# EAGLE design ASD2412 (EAGLE 6.3)
DATABASE: ./../../../../../Components/TinyCircuits_Part_Database.txt
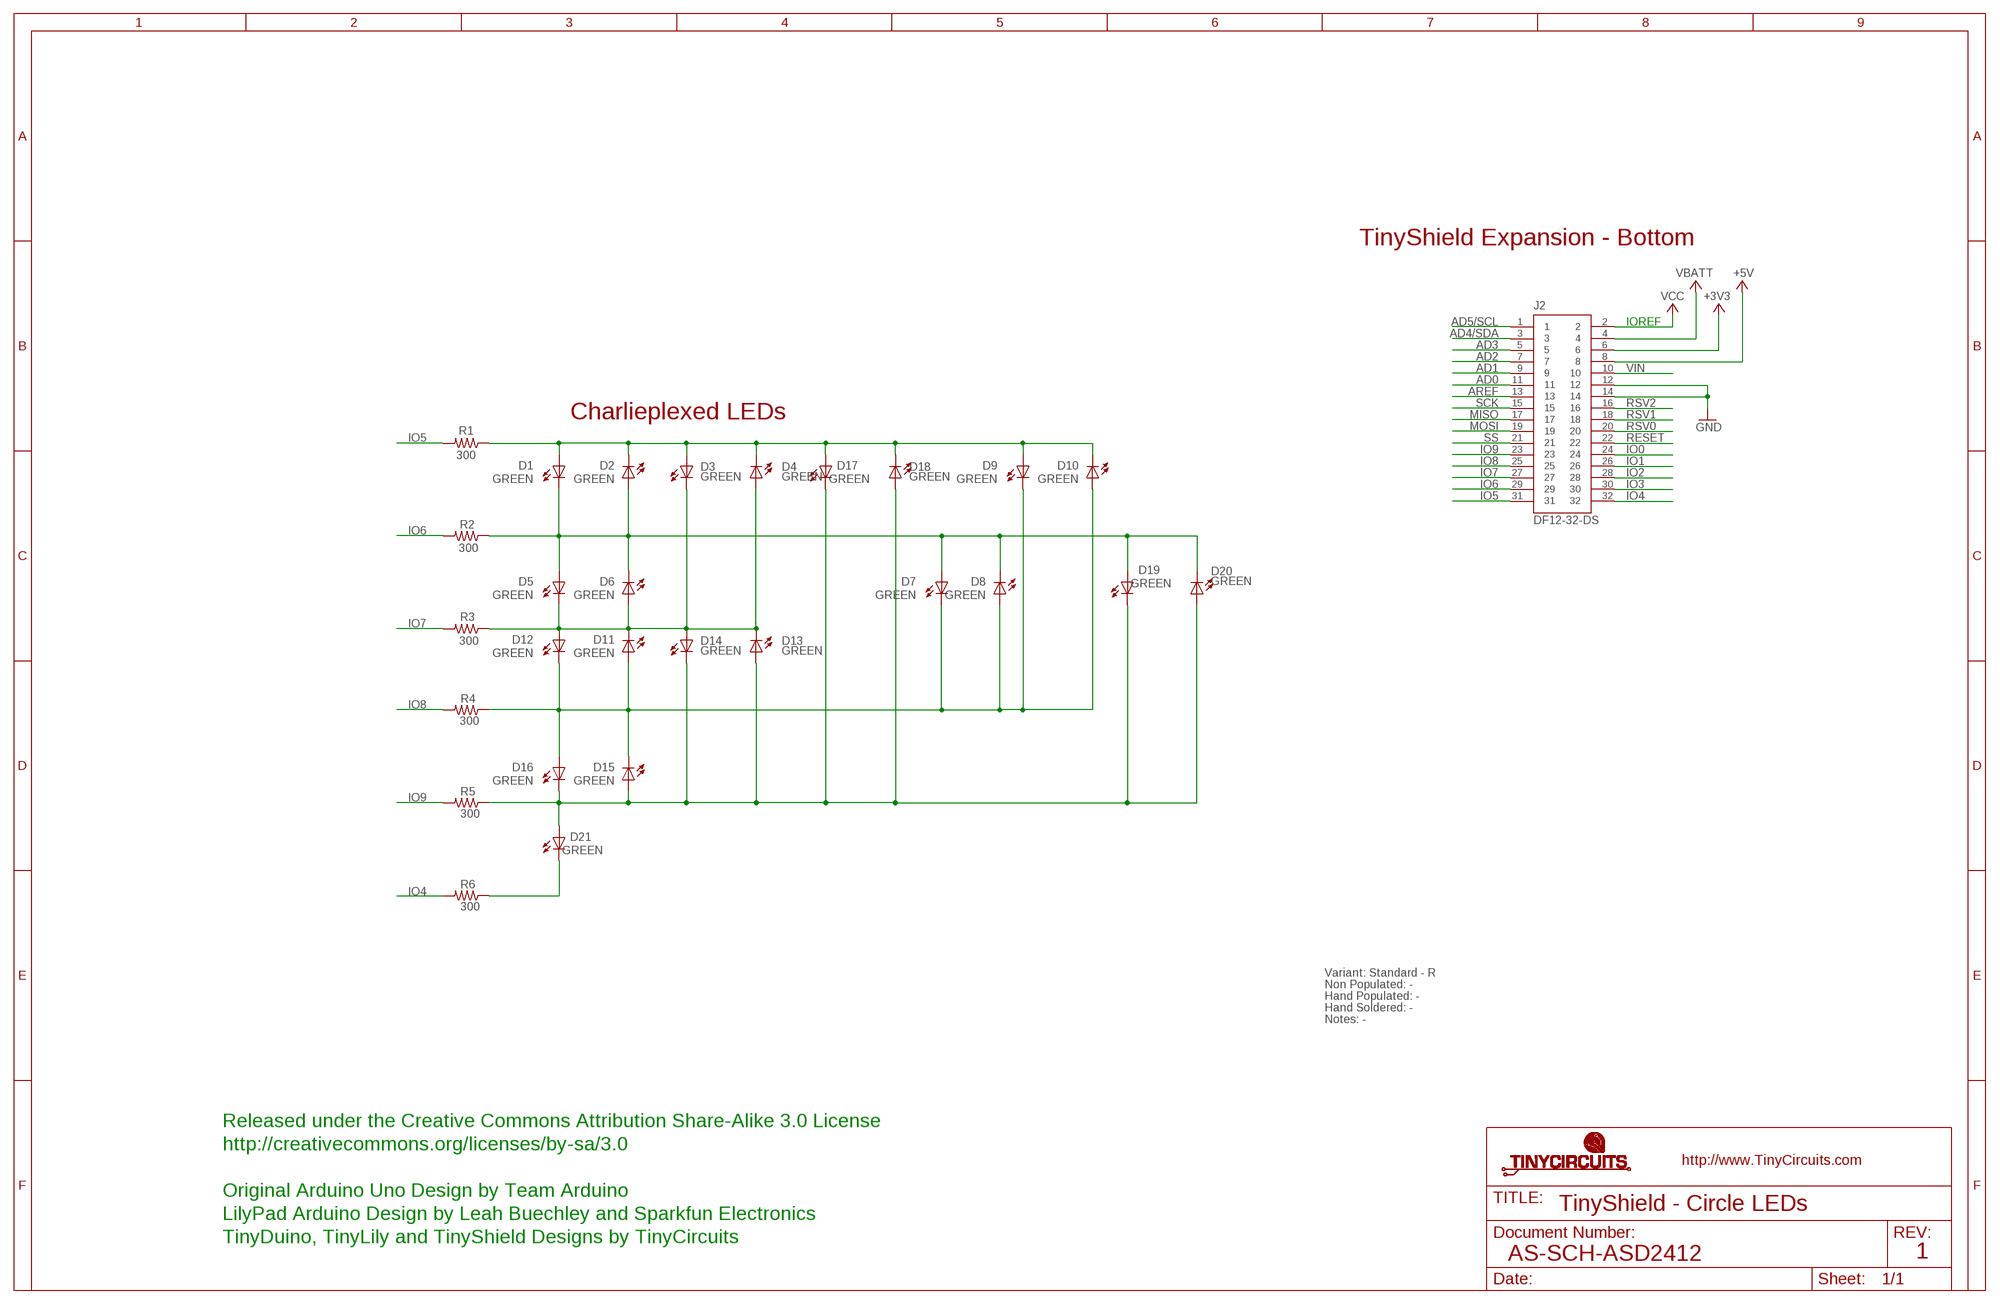
[diagram p0: schematic, sheet 1]

## Parts
D1  GREEN  AS-ITM-00011  [LNJ_LED]
D2  GREEN  AS-ITM-00011  [LNJ_LED]
D3  GREEN  AS-ITM-00011  [LNJ_LED]
D4  GREEN  AS-ITM-00011  [LNJ_LED]
D5  GREEN  AS-ITM-00011  [LNJ_LED]
D6  GREEN  AS-ITM-00011  [LNJ_LED]
D7  GREEN  AS-ITM-00011  [LNJ_LED]
D8  GREEN  AS-ITM-00011  [LNJ_LED]
D9  GREEN  AS-ITM-00011  [LNJ_LED]
D10  GREEN  AS-ITM-00011  [LNJ_LED]
D11  GREEN  AS-ITM-00011  [LNJ_LED]
D12  GREEN  AS-ITM-00011  [LNJ_LED]
D13  GREEN  AS-ITM-00011  [LNJ_LED]
D14  GREEN  AS-ITM-00011  [LNJ_LED]
D15  GREEN  AS-ITM-00011  [LNJ_LED]
D16  GREEN  AS-ITM-00011  [LNJ_LED]
D17  GREEN  AS-ITM-00011  [LNJ_LED]
D18  GREEN  AS-ITM-00011  [LNJ_LED]
D19  GREEN  AS-ITM-00011  [LNJ_LED]
D20  GREEN  AS-ITM-00011  [LNJ_LED]
D21  GREEN  AS-ITM-00011  [LNJ_LED]
J2  DF12-32-DS  AS-ITM-00012  [DF12-32-DS]
R1  300  AS-ITM-00016  [0402]
R2  300  AS-ITM-00016  [0402]
R3  300  AS-ITM-00016  [0402]
R4  300  AS-ITM-00016  [0402]
R5  300  AS-ITM-00016  [0402]
R6  300  AS-ITM-00016  [0402]

## Nets
+3V3: J2.6
+5V: J2.8
AD0: J2.11
AD1: J2.9
AD2: J2.7
AD3: J2.5
AD4/SDA: J2.3
AD5/SCL: J2.1
AREF: J2.13
GND: J2.12 J2.14
IO0: J2.24
IO1: J2.26
IO2: J2.28
IO3: J2.30
IO4: J2.32 R6.2
IO5: J2.31 R1.2
IO6: J2.29 R2.2
IO7: J2.27 R3.2
IO8: J2.25 R4.2
IO9: J2.23 R5.2
MISO: J2.17
MOSI: J2.19
N$1: D1.C D2.A D5.A D6.C D7.A D8.C D19.A D20.C R2.1
N$3: D21.C R6.1
N$11: D1.A D2.C D3.A D4.C D9.A D10.C D17.A D18.C R1.1
N$13: D3.C D4.A D5.C D6.A D11.C D12.A D13.C D14.A R3.1
N$14: D7.C D8.A D9.C D10.A D11.A D12.C D15.C D16.A R4.1
N$15: D13.A D14.C D15.A D16.C D17.C D18.A D19.C D20.A D21.A R5.1
RESET: J2.22
RSV0: J2.20
RSV1: J2.18
RSV2: J2.16
SCK: J2.15
SS: J2.21
VBATT: J2.4
VCC: J2.2
VIN: J2.10

## Notes on the sheet
- TinyShield Expansion - Bottom
- IOREF
- Charlieplexed LEDs
- Variant: Standard - R
- Non Populated: -
- Hand Populated: -
- Hand Soldered: -
- Notes: -
- Released under the Creative Commons Attribution Share-Alike 3.0 License
- http://creativecommons.org/licenses/by-sa/3.0
- Original Arduino Uno Design by Team Arduino
- TinyShield - Circle LEDs
- LilyPad Arduino Design by Leah Buechley and Sparkfun Electronics
- TinyDuino, TinyLily and TinyShield Designs by TinyCircuits
- AS-SCH-ASD2412 | 1

## Library data of the parts
D1-D21 = tinycircuits:AS-ITM-00011: LED GREEN SIDE VIEW SMD; PARTNO: AS-ITM-00011; PNPROTATION: 90
J2 = tinycircuits:AS-ITM-00012: CONN RECEPT 32POS 3MM SMD 0.5MM; PARTNO: AS-ITM-00012
R1-R6 = tinycircuits:AS-ITM-00016: RES 300 OHM 1/16W 1% 0402; PARTNO: AS-ITM-00016

## Board
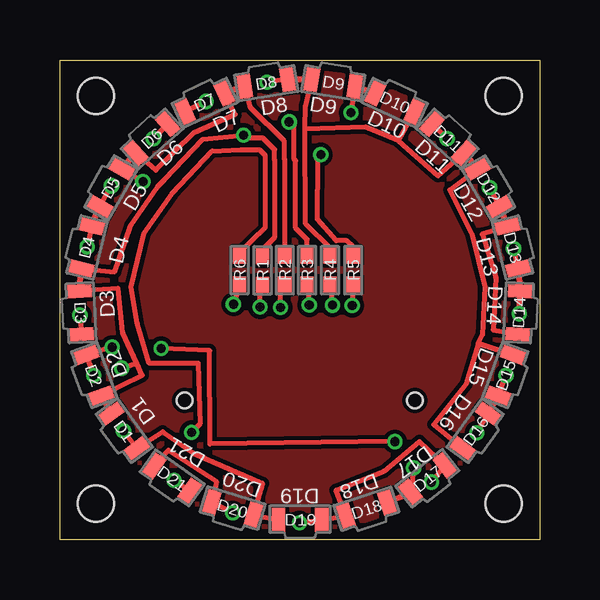
[diagram p1: board, top side]
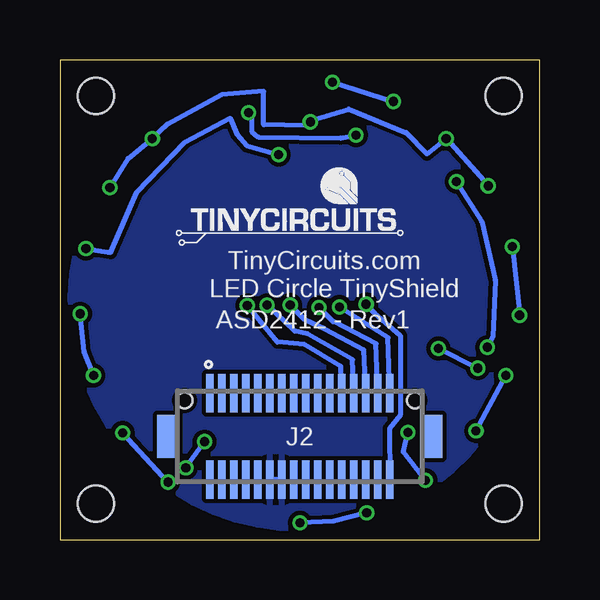
[diagram p2: board, bottom side, seen from below]

Size 20 x 20 mm. Coordinates in mm from the lower left corner, seen from the top.
Outline: 0,20 20,20 20,0 0,0 0,20
Copper layers (1*16): Top 0.035mm / dielectric 1.5mm / Bottom 0.035mm
Design rules "default *": minimum track width 8mil, minimum drill 15mil, track to track 7mil, track to pad 7mil, pad to pad 7mil, via to via 7mil, smd to smd 7mil, copper to edge 8mil, drill to drill 8mil, minimum pad ring 10mil, minimum via ring 5mil, stop-mask expansion 4mil, vias tented up to drill 25mil, thermal gap 10mil
Holes 1.5 mm at 1.5,18.5 18.5,18.5 18.5,1.5 1.5,1.5

### Footprints (pad centres in the part's own frame; a part is rotated, then mirrored left to right if it is on the bottom)
LNJ_LED = smd 1 x 0.55: A 0,0.9; C 0,-0.9
DF12-32-DS = smd 0.3 x 1.6: 1 -3.75,1.8; 2 -3.75,-1.8; 3 -3.25,1.8; 4 -3.25,-1.8; 5 -2.75,1.8; 6 -2.75,-1.8; 7 -2.25,1.8; 8 -2.25,-1.8; 9 -1.75,1.8; 10 -1.75,-1.8; 11 -1.25,1.8; 12 -1.25,-1.8; 13 -0.75,1.8; 14 -0.75,-1.8; 15 -0.25,1.8; 16 -0.25,-1.8; 17 0.25,1.8; 18 0.25,-1.8; 19 0.75,1.8; 20 0.75,-1.8; 21 1.25,1.8; 22 1.25,-1.8; 23 1.75,1.8; 24 1.75,-1.8; 25 2.25,1.8; 26 2.25,-1.8; 27 2.75,1.8; 28 2.75,-1.8; 29 3.25,1.8; 30 3.25,-1.8; 31 3.75,1.8; 32 3.75,-1.8 | smd 0.9 x 1.8: F1 -5.5,0; F2 5.5,0 | hole 0.65: -4.8,1.5; 4.8,1.5
0402 = smd 0.65 x 0.55: 1 -0.6,0; 2 0.6,0

### Placement (x,y rotation side)
D1  2.66,4.53 36 top
D2  1.41,6.85 20 top
D3  0.86,9.46 3 top
D4  1.11,12.18 346 top
D5  2.12,14.67 330 top
D6  3.82,16.73 312 top
D7  6.03,18.23 295 top
D8  8.6,19.05 279 top
D9  11.4,19.05 261 top
D10  13.97,18.23 245 top
D11  16.18,16.73 228 top
D12  17.88,14.67 210 top
D13  18.89,12.18 194 top
D14  19.14,9.46 177 top
D15  18.59,6.85 160 top
D16  17.34,4.53 144 top
D17  15.34,2.53 128 top
D18  12.78,1.26 108 top
D19  10.02,0.83 90 top
D20  7.2,1.29 73 top
D21  4.67,2.55 55 top
J2  10,4.3 0 bottom
R1  8.45,11.22 270 top
R2  9.38,11.24 270 top
R3  10.31,11.24 270 top
R4  11.26,11.24 270 top
R5  12.23,11.24 270 top
R6  7.49,11.23 270 top
U$1  [DOCFIELD-TINYCIRCUITS-PCB]  33.91,-10 0 top  (outside the outline)

### Tracks (layer width: path | path; a pad name or v marks a point on that pad's centre or on a via)
GND
  Bottom 0.254: J2.12 J2.14
  pour Top: 18.49,5.61 arc180 1.54,14.32 arc180
  pour Bottom: 18.49,5.62 arc180 1.54,14.33 arc180
IO4  (via drill 0.38)
  Top 0.203: R6.2 v7.23,9.81
  Bottom 0.203: v7.23,9.81 6.88,9.46 5.81,8.5 5.81,5.19 6.26,4.63 6.23,2.52 J2.32
IO5  (via drill 0.38)
  Top 0.203: v8.34,9.7 8.34,10.52 R1.2
  Bottom 0.203: J2.31 6.31,8.42 v8.34,9.7
IO6  (via drill 0.38)
  Top 0.203: v9.2,9.67 9.2,10.46 R2.2
  Bottom 0.203: J2.29 6.81,8.17 8.57,9.09 8.62,9.09 v9.2,9.67
IO7  (via drill 0.38)
  Top 0.203: R3.2 v10.4,9.79
  Bottom 0.203: v10.41,9.8 v10.4,9.79 9.77,9.16 8.97,8.78 7.33,7.91 J2.27
IO8  (via drill 0.38)
  Top 0.203: R4.2 v11.36,9.77
  Bottom 0.203: J2.25 7.8,7.51 9.67,8.58 10.22,8.69 v11.36,9.77
IO9  (via drill 0.38)
  Top 0.203: R5.2 v12.19,9.76
  Bottom 0.203: 12.17,9.77 v12.19,9.76 10.93,8.24 9.81,8.14 8.29,7.22 J2.23
N$1  (via drill 0.38)
  Top 0.203: R2.1 9.38,15.85 9.36,15.87 9.36,16.61 7.95,18.02 D8.C | D7.A 7.31,17.72 5.58,16.95 3.99,15.4 D6.C | v1.4,6.84 D2.A v2.18,8.02 | v2.65,4.53 D1.C 4.29,4.49 5.57,3.6 8.44,2.34 D20.C D19.A | D5.A v3.46,14.93
  Top 0.254: D5.A D6.C | D8.C D7.A
  Bottom 0.203: v1.4,6.84 v2.65,4.53 | v3.46,14.93 2.41,13.25 1.85,10.8 1.95,8.44 v2.18,8.02
N$3  (via drill 0.38)
  Top 0.203: D21.C v4.76,2.47 | v5.49,4.46 5.86,4.85 5.8,6.7 5.77,7.35 3.73,7.35 3.22,9.02 2.97,10.52 3.51,12.78 4.67,14.43 6.34,16.2 7.54,16.25 8.33,16.25 8.54,16.04 8.54,12.99 7.49,11.97 R6.1
  Bottom 0.203: v4.76,2.47 5.68,3.65 v5.49,4.46
N$11  (via drill 0.38)
  Top 0.203: R1.1 8.45,12.1 8.96,12.62 8.96,15.82 8.95,15.83 8.95,16.26 8.47,16.75 7.77,16.75 v7.65,16.86 5.96,16.7 4.36,15.02 4.08,14.74 2.95,13.1 2.28,11.16 D4.C | D9.A v12.14,17.8 | D2.C 3.44,6.85 3.2,7.36 | 3.2,7.36 2.62,8.63 2.42,10.47 D3.A | D17.A D18.C 14.7,1.94 14.74,2.85 v14.75,2.99 | v13.96,4.08 6.26,3.98 6.24,7.88 v4.22,7.97 | v2.57,7.14 3.2,7.36
  Top 0.254: D1.A D2.C | D3.A D4.C | D9.A D10.C
  Bottom 0.203: 7.64,17.01 7.65,17 v7.65,16.86 8.3,16.75 11.73,16.78 12.01,17.01 12.01,17.76 v12.14,17.8 | v14.75,2.99 v13.96,4.08 | v4.22,7.97 v2.57,7.14
N$13  (via drill 0.38)
  Top 0.203: R3.1 10.31,12.52 9.82,13 9.82,15.79 9.76,15.86 9.76,17.27 v9.56,17.42 | D6.A v3.89,16.72 | v2.14,14.75 D5.C | D4.A v1.14,12.21 | v0.83,9.36 D3.C | D12.A v17.91,14.68 | v16.15,16.72 D11.C | D13.C 17.61,12.73 18.17,10.92 18.07,8.75 D14.A
  Top 0.254: D4.A D5.C | D13.C D12.A
  Bottom 0.203: v2.14,14.75 v3.89,16.72 4.71,16.07 5.57,16.98 7.96,17.95 9.49,17.5 9.61,17.38 v9.56,17.42 9.76,17.27 11.5,17.29 11.5,18.69 13.27,18.55 D11.C v16.15,16.72 17.16,15.89 v17.91,14.68 | v1.14,12.21 v0.83,9.36
N$14  (via drill 0.38)
  Top 0.203: R4.1 11.26,12.15 10.24,13.16 10.22,17.11 | 10.22,17.11 10.24,18.11 10.26,18.12 D9.C | D10.A 14.11,16.63 | 14.11,16.63 15.77,15.17 D11.A | D8.A v8.63,19.07 | v6.09,18.27 D7.C | 14.11,16.63 12.75,17.2 10.22,17.11 | D12.C 16.25,14.57 17.18,12.73 17.72,10.52 17.62,8.54 17.43,8.17 D15.C 17.45,8.17 16.92,6.46 15.59,4.8 D16.A
  Top 0.254: D8.A D9.C | D11.A D12.C
  Bottom 0.203: v8.63,19.07 v6.09,18.27
N$15  (via drill 0.38)
  Top 0.203: R5.1 12.23,12.19 11.96,12.47 11.53,12.47 10.74,13.36 10.75,15.84 10.71,15.88 10.92,16.11 v10.88,16.05 | D15.A v18.6,6.84 | v19.16,9.42 D14.C | D13.A v18.92,12.14 | D21.A 4.53,3.73 6.52,2.42 D20.A v7.21,1.11 | v9.99,0.69 D19.C D18.A 11.51,2.05 13.51,2.85 14.99,4.08 D17.C v15.49,2.39 | v17.38,4.45 D16.C
  Top 0.254: D13.A D14.C | D16.C D15.A
  Bottom 0.203: v18.6,6.84 18.98,7.83 v19.16,9.42 | v18.92,12.14 17.88,11.97 16.81,14.47 14.79,16.57 12.9,17.57 12.62,16.89 12.21,16.43 v10.88,16.05 10.75,15.87 10.83,15.96 10.84,16.05 | v7.21,1.11 8.59,0.77 v9.99,0.69 | v15.49,2.39 v17.38,4.45

### Text on the board
tPlace: D8 | D9 | D7 | D10 | D6 | D11 | D12 | D5 | D13 | D4 | D14 | D3 | D15 | D2 | D16 | D1 | D17 | D21 | D18 | D20 | D19
bPlace: TinyCircuits.com | LED Circle TinyShield | ASD2412 - Rev1
Document: FABRICATION DRAWING | NOTES: | 1. PRINTED CIRCUIT BOARD MADE FROM NEMA GRADE FR-4 EPOXY LAMINATE | WITH 1 OUNCE COPPER PLATING AND .024 THICKNESS. | 2. ALL DIMENSIONS ARE GIVEN IN INCHES. | 3. CIRCUIT PATHS ARE FOR REFERENCE ONLY. | 4. HOLE SIZES SHOWN ARE FINISHED DIAMETERS AFTER PLATING. | 5. BOARD PLATED USING REFLOW OR SIMILAR METHOD. | 6. BOARD TO HAVE BLUE SOLDER MASK ON PLATED SURFACES USING WET FILM | 7. SILKSCREEN BOARD USING WHITE INK. | SR100 OR SR1010 EPOXY. EQUIVALENT WET OR DRY FILM MAY BE USED. | 8. THE FOLLOWING INFORMATION APPLIES TO THIS BOARD: | * 2 COPPER LAYERS | * .024 BOARD THICKNESS | * REQUIRES TOP SIDE SILKSCREEN | Released under the Creative Commons Attribution Share-Alike 3.0 License | http://creativecommons.org/licenses/by-sa/3.0 | Original Arduino Uno Design by Team Arduino | LilyPad Arduino Design by Leah Buechley and Sparkfun Electronics | TinyDuino, TinyLily and TinyShield Designs by TinyCircuits | TinyShield - Circle LEDs | AS-PCB-ASD2412 | 1